# Altium schematic sheet Debug Interface.SchDoc
size A4; Organization: TESLA Motors, INC; Address1: 3500 Deer Creek Road; Address2: Palo Alto, CA; Address4: U.S.A.; SheetNumber: 21; SheetTotal: 21
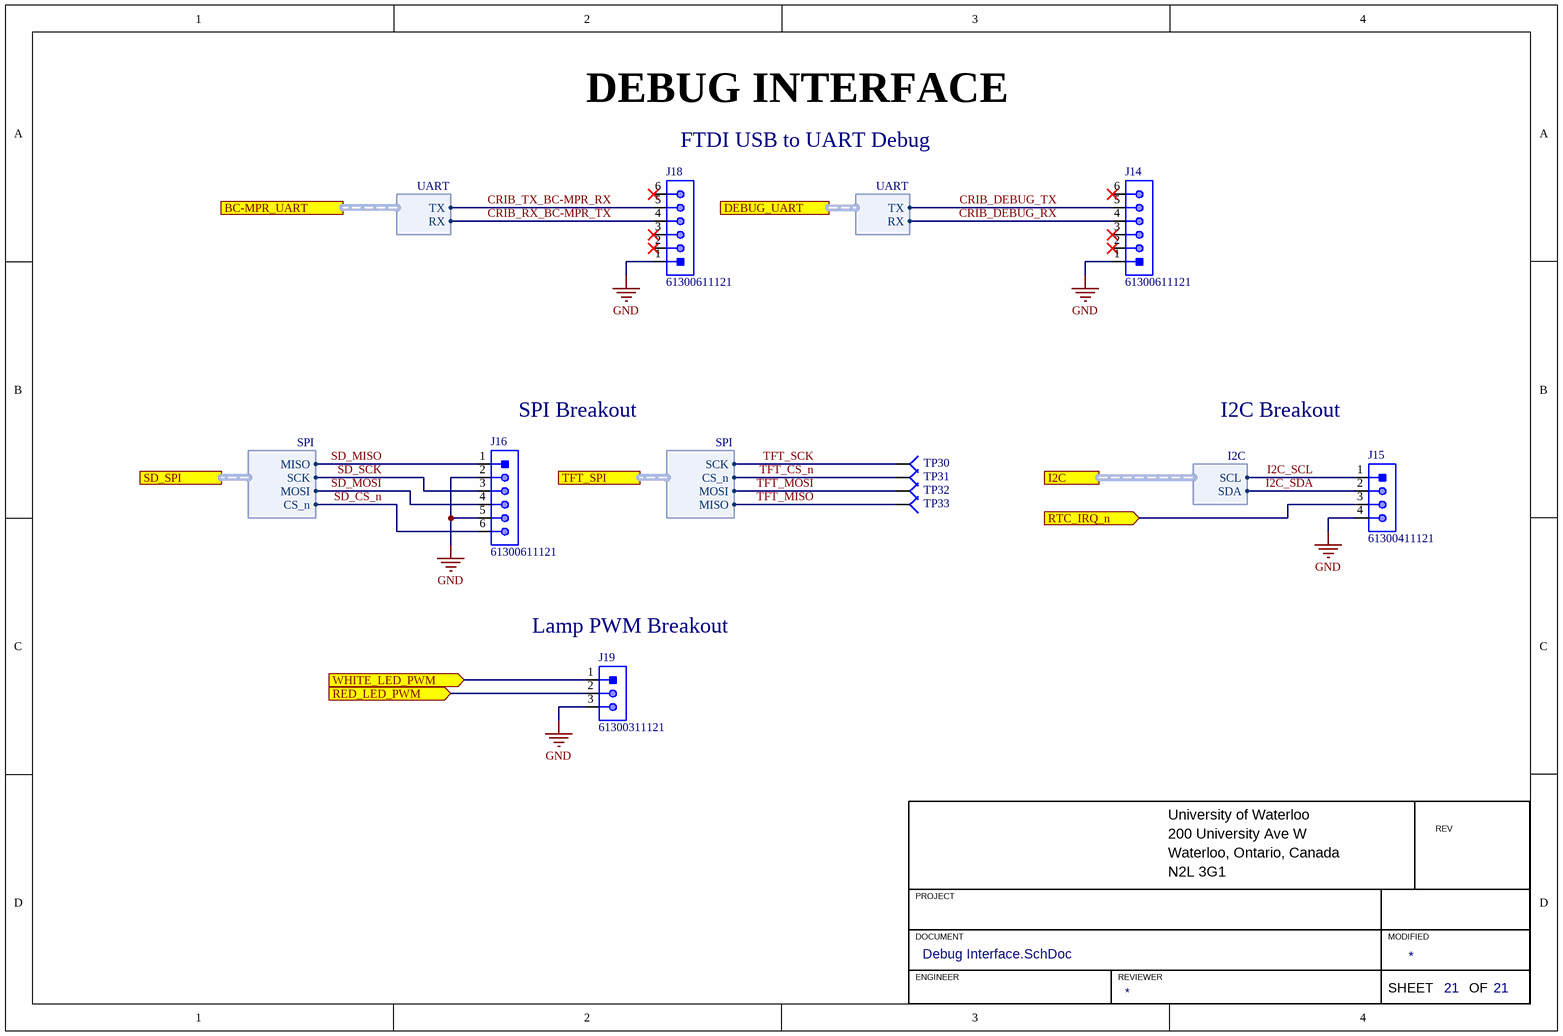
[diagram p0: Debug Interface.SchDoc]

## Parts
J14  Manufacturer Part Number 1: 61300611121  [HDR1X6]  (hidden comment: HEADER 6x1)
J15  Manufacturer Part Number 1: 61300411121  [HDR1X4]  (hidden comment: HEADER 4x1)
J16  Manufacturer Part Number 1: 61300611121  [HDR1X6]  (hidden comment: HEADER 6x1)
J18  Manufacturer Part Number 1: 61300611121  [HDR1X6]  (hidden comment: HEADER 6x1)
J19  Manufacturer Part Number 1: 61300311121  [HDR1X3]  (hidden comment: HEADER 3x1)
TP30  TESTPOINT_1MM_CIRCLE  [TESTPOINT_CIRCLE_1MM]  (value not drawn)  (no BOM)
TP31  TESTPOINT_1MM_CIRCLE  [TESTPOINT_CIRCLE_1MM]  (value not drawn)  (no BOM)
TP32  TESTPOINT_1MM_CIRCLE  [TESTPOINT_CIRCLE_1MM]  (value not drawn)  (no BOM)
TP33  TESTPOINT_1MM_CIRCLE  [TESTPOINT_CIRCLE_1MM]  (value not drawn)  (no BOM)

## Ports
BC-MPR_UART (harness UART), DEBUG_UART (harness UART), I2C (harness I2C), RED_LED_PWM (in), RTC_IRQ_n (in), SD_SPI (harness SPI), TFT_SPI (harness SPI), WHITE_LED_PWM (in)

## Harnesses
UART: TX, RX
I2C: SCL, SDA
SPI: CS_n, MOSI, MISO, SCK

## Nets
GND: J14.1 J15.4 J16.2 J16.5 J18.1 J19.3
CRIB_DEBUG_RX: J14.4 ; port DEBUG_UART.RX
CRIB_DEBUG_TX: J14.5 ; port DEBUG_UART.TX
CRIB_RX_BC-MPR_TX: J18.4 ; port BC-MPR_UART.RX
CRIB_TX_BC-MPR_RX: J18.5 ; port BC-MPR_UART.TX
I2C_SCL: J15.1 ; port I2C.SCL
I2C_SDA: J15.2 ; port I2C.SDA
RED_LED_PWM: J19.2 ; port RED_LED_PWM
RTC_IRQ_n: J15.3 ; port RTC_IRQ_n
SD_CS_n: J16.6 ; port SD_SPI.CS_n
SD_MISO: J16.1 ; port SD_SPI.MISO
SD_MOSI: J16.4 ; port SD_SPI.MOSI
SD_SCK: J16.3 ; port SD_SPI.SCK
TFT_CS_n: TP31.1(=value) ; port TFT_SPI.CS_n
TFT_MISO: TP33.1(=value) ; port TFT_SPI.MISO
TFT_MOSI: TP32.1(=value) ; port TFT_SPI.MOSI
TFT_SCK: TP30.1(=value) ; port TFT_SPI.SCK
WHITE_LED_PWM: J19.1 ; port WHITE_LED_PWM

Not connected (* = marked no-connect by the designer): J14 2* 3* 6*; J18 2* 3* 6*

## Notes on the sheet
- DEBUG INTERFACE
- (near J18) FTDI USB to UART Debug
- (near J16) SPI Breakout
- I2C Breakout
- (near J19) Lamp PWM Breakout
- University of Waterloo
- 200 University Ave W
- REV
- PROJECT
- Waterloo, Ontario, Canada
- N2L 3G1
- DOCUMENT
- ENGINEER
- REVIEWER
- MODIFIED
- SHEET
- OF

## Library data of the parts
J14 J16 J18 = HEADER 6x1: CONN HEADER VERT 6POS 2.54MM; Manufacturer 1: Würth Elektronik; Supplier 1: Digi-Key; Mounting Type: TH; Pitch: 2.54mm; Supplier Part Number 1: 732-5319-ND
J15 = HEADER 4x1: CONN HEADER VERT 4POS 2.54MM; Manufacturer 1: Würth Elektronik; Mounting Type: TH; Pitch: 2.54mm; Supplier 1: Digikey; Supplier Part Number 1: 732-5317-ND
J19 = HEADER 3x1: CONN HEADER VERT 3POS 2.54MM; Manufacturer 1: Würth Elektronik; Supplier 1: Digi-Key; Mounting Type: TH; Pitch: 2.54mm; Supplier Part Number 1: 732-5316-ND
TP30-TP33 = TESTPOINT_1MM_CIRCLE: TESTPOINT 1MM CIRCLE